# Altium schematic sheet samll car.SchDoc
size A3; SheetNumber: 1; SheetTotal: 1
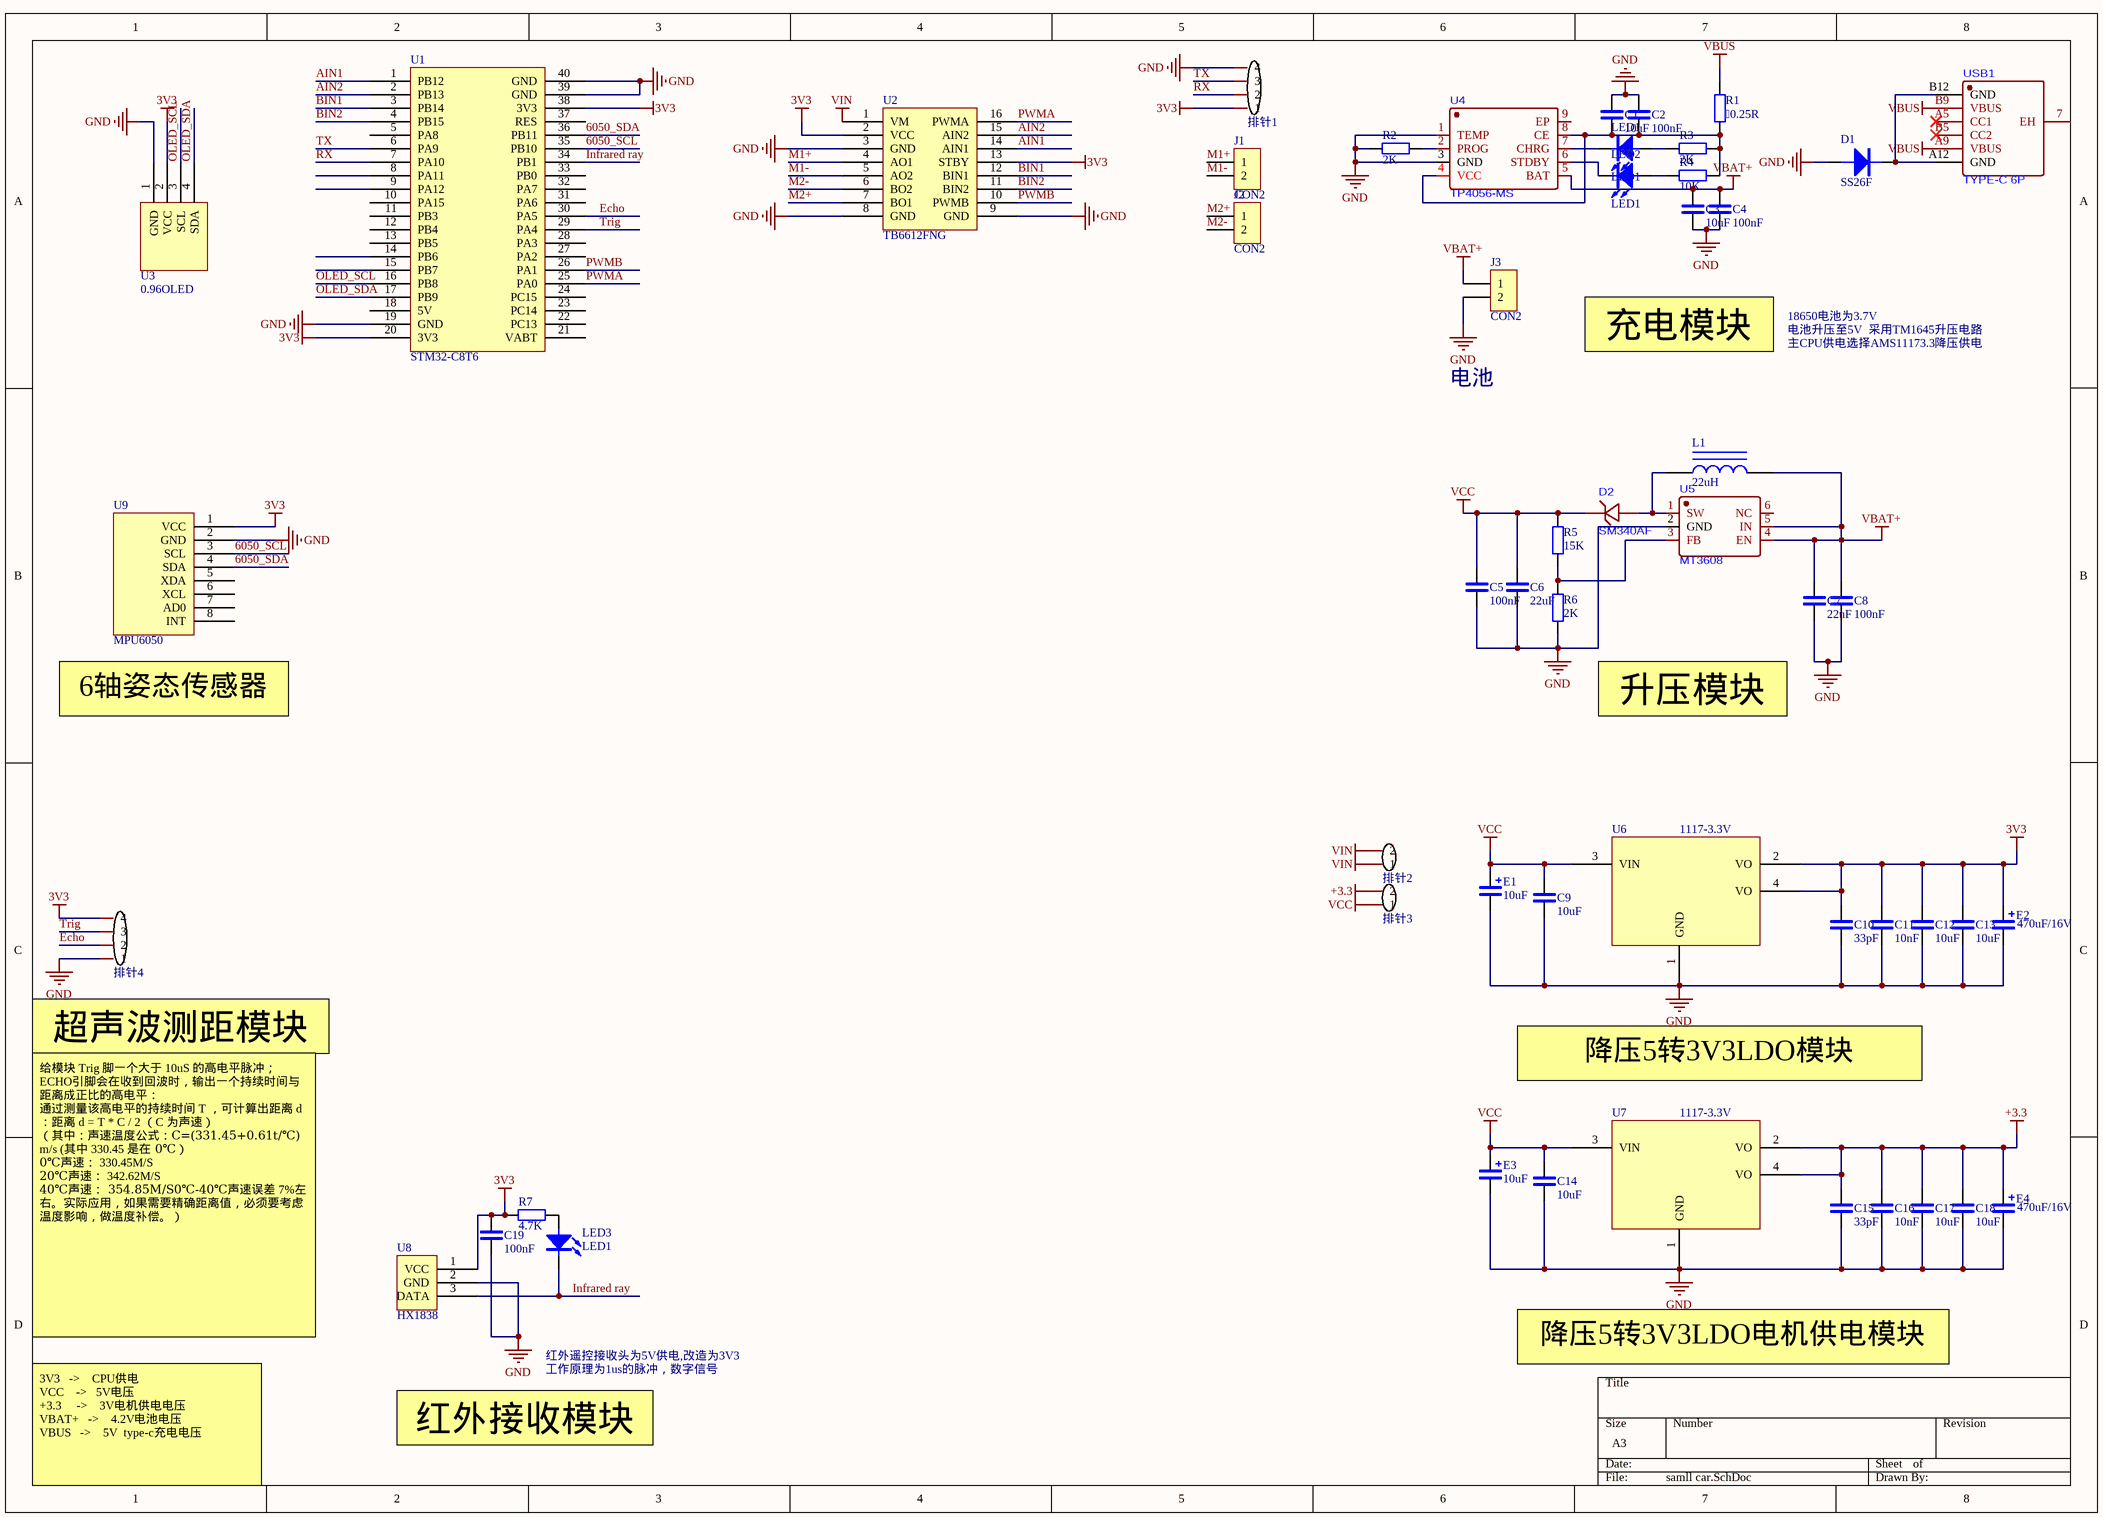
[diagram p0: samll car.SchDoc]

## Parts
C1  10uF  [C0603]
C2  100nF  [C0603]
C3  10uF  [C0603]
C4  100nF  [C0603]
C5  100nF  [C0603]
C6  22uF  [C0603]
C7  22uF  [C0603]
C8  100nF  [C0603]
C9  10uF  [C0603]
C10  33pF  [C0603]
C11  10nF  [C0603]
C12  10uF  [C0603]
C13  10uF  [C0603]
C14  10uF  [C0603]
C15  33pF  [C0603]
C16  10nF  [C0603]
C17  10uF  [C0603]
C18  10uF  [C0603]
C19  100nF  [C0603]
D1  SS26F  [SMAF]
D2  SM340AF  [SMA-FL-RD]
E1  10uF  [CAP-TANTALUM-A]
E2  470uF/16V  [CAP-TH_BD6.0-P2.50-D0.5-FD]
E3  10uF  [CAP-TANTALUM-A]
E4  470uF/16V  [CAP-TH_BD6.0-P2.50-D0.5-FD]
J1  CON2  [XH2.54-2PZZ]
J2  CON2  [XH2.54-2PZZ]
J3  CON2  [XH2.54-2PZZ]
L1  22uH  [IND-SMD_L5.0-W5.0]
LED1  LED1  [LED-0603]
LED2  LED1  [LED-0603]
LED3  LED1  [LED-0603]
R1  0.25R  [R1206]
R2  2K  [R0603]
R3  2K  [R0603]
R4  10K  [R0603]
R5  15K  [R0603]
R6  2K  [R0603]
R7  4.7K  [R0603]
U1  STM32-C8T6  [STM32-C8T6]
U2  TB6612FNG  [TB6612FNG]
U3  0.96OLED  [0.96OLED]
U4  TP4056-MS  [SOP-8-TL-EP]
U5  MT3608  [SOT-23-6]
U6  1117-3.3V  [SOT-223]
U7  1117-3.3V  [SOT-223]
U8  HX1838  [VS/HX1838B]
U9  MPU6050  [MPU6050]
USB1  TYPE-C 6P  [TYPE-C-6P]
排针1  4P 排针  [XH2.54-1*4]  (value not drawn)
排针2  2P 排针  [XH2.54-1*2]  (value not drawn)
排针3  2P 排针  [XH2.54-1*2]  (value not drawn)
排针4  4P 排针  [XH2.54-1*4]  (value not drawn)

## Nets
3V3: C10.2 C11.2 C12.2 C13.2 C19.1 E2.1 R7.2 U1.20(3V3) U1.38(3V3) U2.2(VCC) U2.13(STBY) U3.2(VCC) U6.2(VO) U6.4(VO) U8.1(VCC) U9.1(VCC) 排针1.1 排针4.4
+3.3: C15.2 C16.2 C17.2 C18.2 E4.1 U7.2(VO) U7.4(VO) 排针3.2
GND: C1.1 C2.1 C3.2 C4.2 C5.2 C6.2 C7.2 C8.2 C9.1 C10.1 C11.1 C12.1 C13.1 C14.1 C15.1 C16.1 C17.1 C18.1 C19.2 D1.1 E1.2 E2.2 E3.2 E4.2 J3.2 R2.1 R6.2 U1.19(GND) U1.39(GND) U1.40(GND) U2.3(GND) U2.8(GND) U2.9(GND) U3.1(GND) U4.1(TEMP) U4.3(GND) U5.2(GND) U6.1(GND) U7.1(GND) U8.2(GND) U9.2(GND) 排针1.4 排针4.1
VBAT+: C3.1 C4.1 C7.1 C8.1 J3.1 L1.2 U4.5(BAT) U5.4(EN) U5.5(IN)
VBUS: R1.1 USB1.A9(VBUS) USB1.B9(VBUS)
VCC: C5.1 C6.1 C9.2 C14.2 D2.1(C) E1.1 E3.1 R5.1 U6.3(VIN) U7.3(VIN) 排针3.1
VIN: U2.1(VM) 排针2.1 排针2.2
6050_SCL: U1.35(PB10) U9.3(SCL)
6050_SDA: U1.36(PB11) U9.4(SDA)
AIN1: U1.1(PB12) U2.14(AIN1)
AIN2: U1.2(PB13) U2.15(AIN2)
BIN1: U1.3(PB14) U2.12(BIN1)
BIN2: U1.4(PB15) U2.11(BIN2)
Echo: U1.30(PA5) 排针4.2
Infrared ray: LED3.2(C) U1.34(PB1) U8.3(DATA)
M1+: J1.1 U2.4(AO1)
M1-: J1.2 U2.5(AO2)
M2+: J2.1 U2.7(BO1)
M2-: J2.2 U2.6(BO2)
OLED_SCL: U1.16(PB8) U3.3(SCL)
OLED_SDA: U1.17(PB9) U3.4(SDA)
PWMA: U1.25(PA0) U2.16(PWMA)
PWMB: U1.26(PA1) U2.10(PWMB)
RX: U1.7(PA10) 排针1.2
Trig: U1.29(PA4) 排针4.3
TX: U1.6(PA9) 排针1.3
NetC1_2: C1.2 C2.2 R1.2 R3.1 R4.1 U4.4(VCC) U4.8(CE)
NetD1_2: D1.2 USB1.A12(GND) USB1.B12(GND)
NetD2_2: D2.2(A) L1.1 U5.1(SW)
NetLED1_1: LED1.1(A) R3.2
NetLED1_2: LED1.2(C) U4.7(CHRG)
NetLED2_1: LED2.1(A) R4.2
NetLED2_2: LED2.2(C) U4.6(STDBY)
NetLED3_1: LED3.1(A) R7.1
NetR2_2: R2.2 U4.2(PROG)
NetR5_2: R5.2 R6.1 U5.3(FB)

Not connected (* = marked no-connect by the designer): U1 5(PA8) 8(PA11) 9(PA12) 10(PA15) 11(PB3) 12(PB4) 13(PB5) 14(PB6) 15(PB7) 18(5V) 21(VABT) 22(PC13) 23(PC14) 24(PC15) 27(PA2) 28(PA3) 31(PA6) 32(PA7) 33(PB0) 37(RES); U4 9(EP); U5 6(NC); U9 5(XDA) 6(XCL) 7(AD0) 8(INT); USB1 7(EH) A5(CC1)* B5(CC2)*

## Notes on the sheet
- 18650电池为3.7V
- 电池
- 充电模块
- 电池升压至5V
- 主CPU供电选择AMS11173.3降压供电
- 采用TM1645升压电路
- (near U9) 6轴姿态传感器
- 升压模块
- (near 排针4) 超声波测距模块
- 降压5转3V3LDO模块
- 给模块 Trig 脚一个大于 10uS 的高电平脉冲；
  ECHO引脚会在收到回波时，输出一个持续时间与距离成正比的高电平：
  通过测量该高电平的持续时间 T ，可计算出距离 d ：距离 d = T * C / 2 （C 为声速）
  （其中：声速温度公式：C=(331.45+0.61t/℃) m/s (其中 330.45 是在 0℃）
  0℃声速： 330.45M/S
  20℃声速： 342.62M/S
  40℃声速： 354.85M/S0℃-40℃声速误差 7%左右。实际应用，如果需要精确距离值，必须要考虑温度影响，做温度补偿。）
- 红外遥控接收头为5V供电,改造为3V3
- 工作原理为1us的脉冲，数字信号
- 降压5转3V3LDO电机供电模块
- 红外接收模块
- 3V3   ->    CPU供电
  VCC    ->   5V电压
  +3.3     ->    3V电机供电电压
  VBAT+   ->    4.2V电池电压
  VBUS   ->    5V  type-c充电电压

## Library data of the parts
C1-C19 = CAP: Capacitor
D1 = 1N4007: Diode
D2 = F1M
E1-E4 = CAP-TANTALUM: Tantalum Capacitor; Value: 10uF/16V
J1-J3 = CON2: Connector
L1 = Inductor Iron: Magnetic-Core Inductor; Published: 24-Mar-1999; LatestRevisionDate: 17-Jul-2002; LatestRevisionNote: Re-released for DXP Platform.; PackageReference: AXIAL-0.9; Publisher: Altium Limited; Value: 22uH
LED1-LED3 = LED1: 单色发光二极管
R1-R7 = RES: Resistor
U6 U7 = 1117: Linear Regulator
排针1 排针4 = 4P 排针: Symbol: 2P 排针; Convert to PCB: yes; Device: 2P 排针; Add into BOM: yes; Supplier Part: C124375; Supplier Footprint: 插件; JLCPCB Part Class: 扩展库
排针2 排针3 = 2P 排针: Convert to PCB: yes; Symbol: 2P 排针; Device: 2P 排针; Add into BOM: yes; Supplier Part: C124375; Supplier Footprint: 插件; JLCPCB Part Class: 扩展库